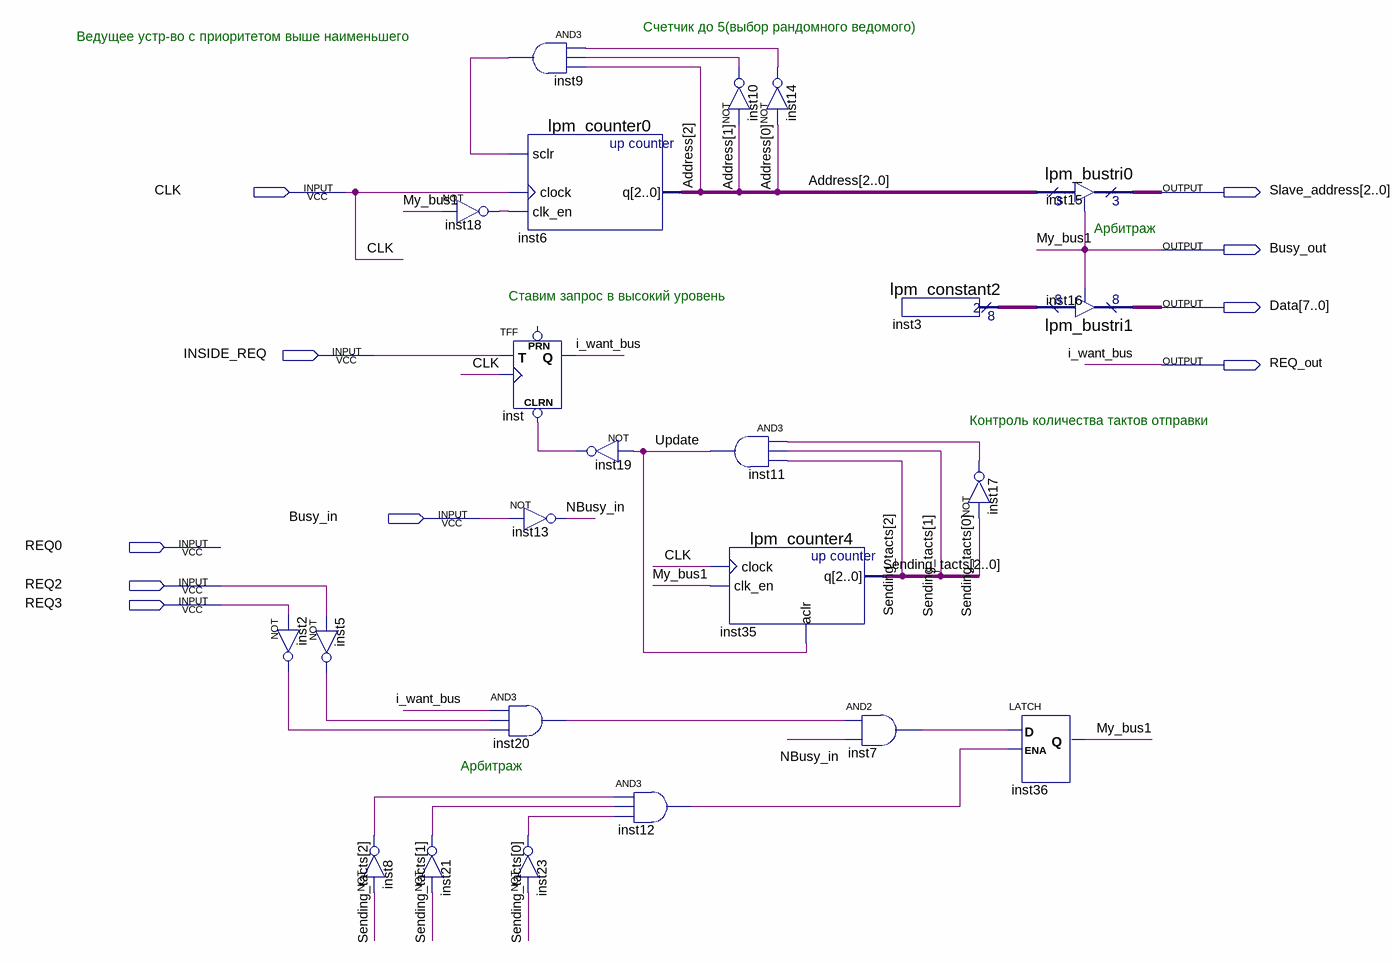
[diagram p0: schematic sheet]
// Quartus schematic Block4.bdf as structural Verilog: 23 symbols, 10 pins
module Block4 (
  input  CLK,
  input  INSIDE_REQ,
  input  Busy_in,
  input  REQ0,
  input  REQ2,
  input  REQ3,
  output [2:0] Slave_address,
  output Busy_out,
  output [7:0] Data,
  output REQ_out
);

  wire inst2_out, inst5_out, inst7_out, inst8_out, inst9_out, inst10_out, inst12_out, inst14_out, inst17_out,
       inst18_out, inst19_out, inst20_out, inst21_out, inst23_out, NBusy_in, Update;
  wire [2:0] Address, Sending_tacts;
  wire [7:0] inst3_result;

  not inst2 (inst2_out, REQ3);
  not inst5 (inst5_out, REQ2);
  not inst8 (inst8_out, Sending_tacts[2]);
  not inst18 (inst18_out, Busy_out);
  not inst21 (inst21_out, Sending_tacts[1]);
  and inst9 (inst9_out, inst14_out, inst10_out, Address[2]);
  lpm_counter0 inst6 (.sclr(inst9_out), .clock(CLK), .clk_en(inst18_out), .q(Address));
  TFF inst (.CLRN(inst19_out), .T(INSIDE_REQ), .CLK(CLK), .Q(REQ_out));  // open: PRN
  not inst13 (NBusy_in, Busy_in);
  and inst20 (inst20_out, REQ_out, inst5_out, inst2_out);
  not inst23 (inst23_out, Sending_tacts[0]);
  not inst19 (inst19_out, Update);
  and inst12 (inst12_out, inst8_out, inst21_out, inst23_out);
  not inst10 (inst10_out, Address[1]);
  and inst11 (Update, inst17_out, Sending_tacts[1], Sending_tacts[2]);
  lpm_counter4 inst35 (.clock(CLK), .clk_en(Busy_out), .aclr(Update), .q(Sending_tacts));
  not inst14 (inst14_out, Address[0]);
  lpm_constant2 inst3 (.result(inst3_result));
  and inst7 (inst7_out, inst20_out, NBusy_in);
  not inst17 (inst17_out, Sending_tacts[0]);
  lpm_bustri0 inst15 (.enabledt(Busy_out), .data(Address), .tridata(Slave_address));
  lpm_bustri1 inst16 (.enabledt(Busy_out), .data(inst3_result), .tridata(Data));
  LATCH inst36 (.D(inst7_out), .ENA(inst12_out), .Q(Busy_out));

  // Other names for the same wires on the sheet: My_bus1 = Busy_out; i_want_bus = REQ_out

  // Notes on the sheet:
  //   Счетчик до 5(выбор рандомного ведомого)
  //   Ведущее устр-во с приоритетом выше наименьшего
  //   Арбитраж
  //   Ставим запрос в высокий уровень
  //   Контроль количества тактов отправки
  //   Арбитраж
endmodule
